# EAGLE design sailpi-hat (EAGLE 7.3.0)
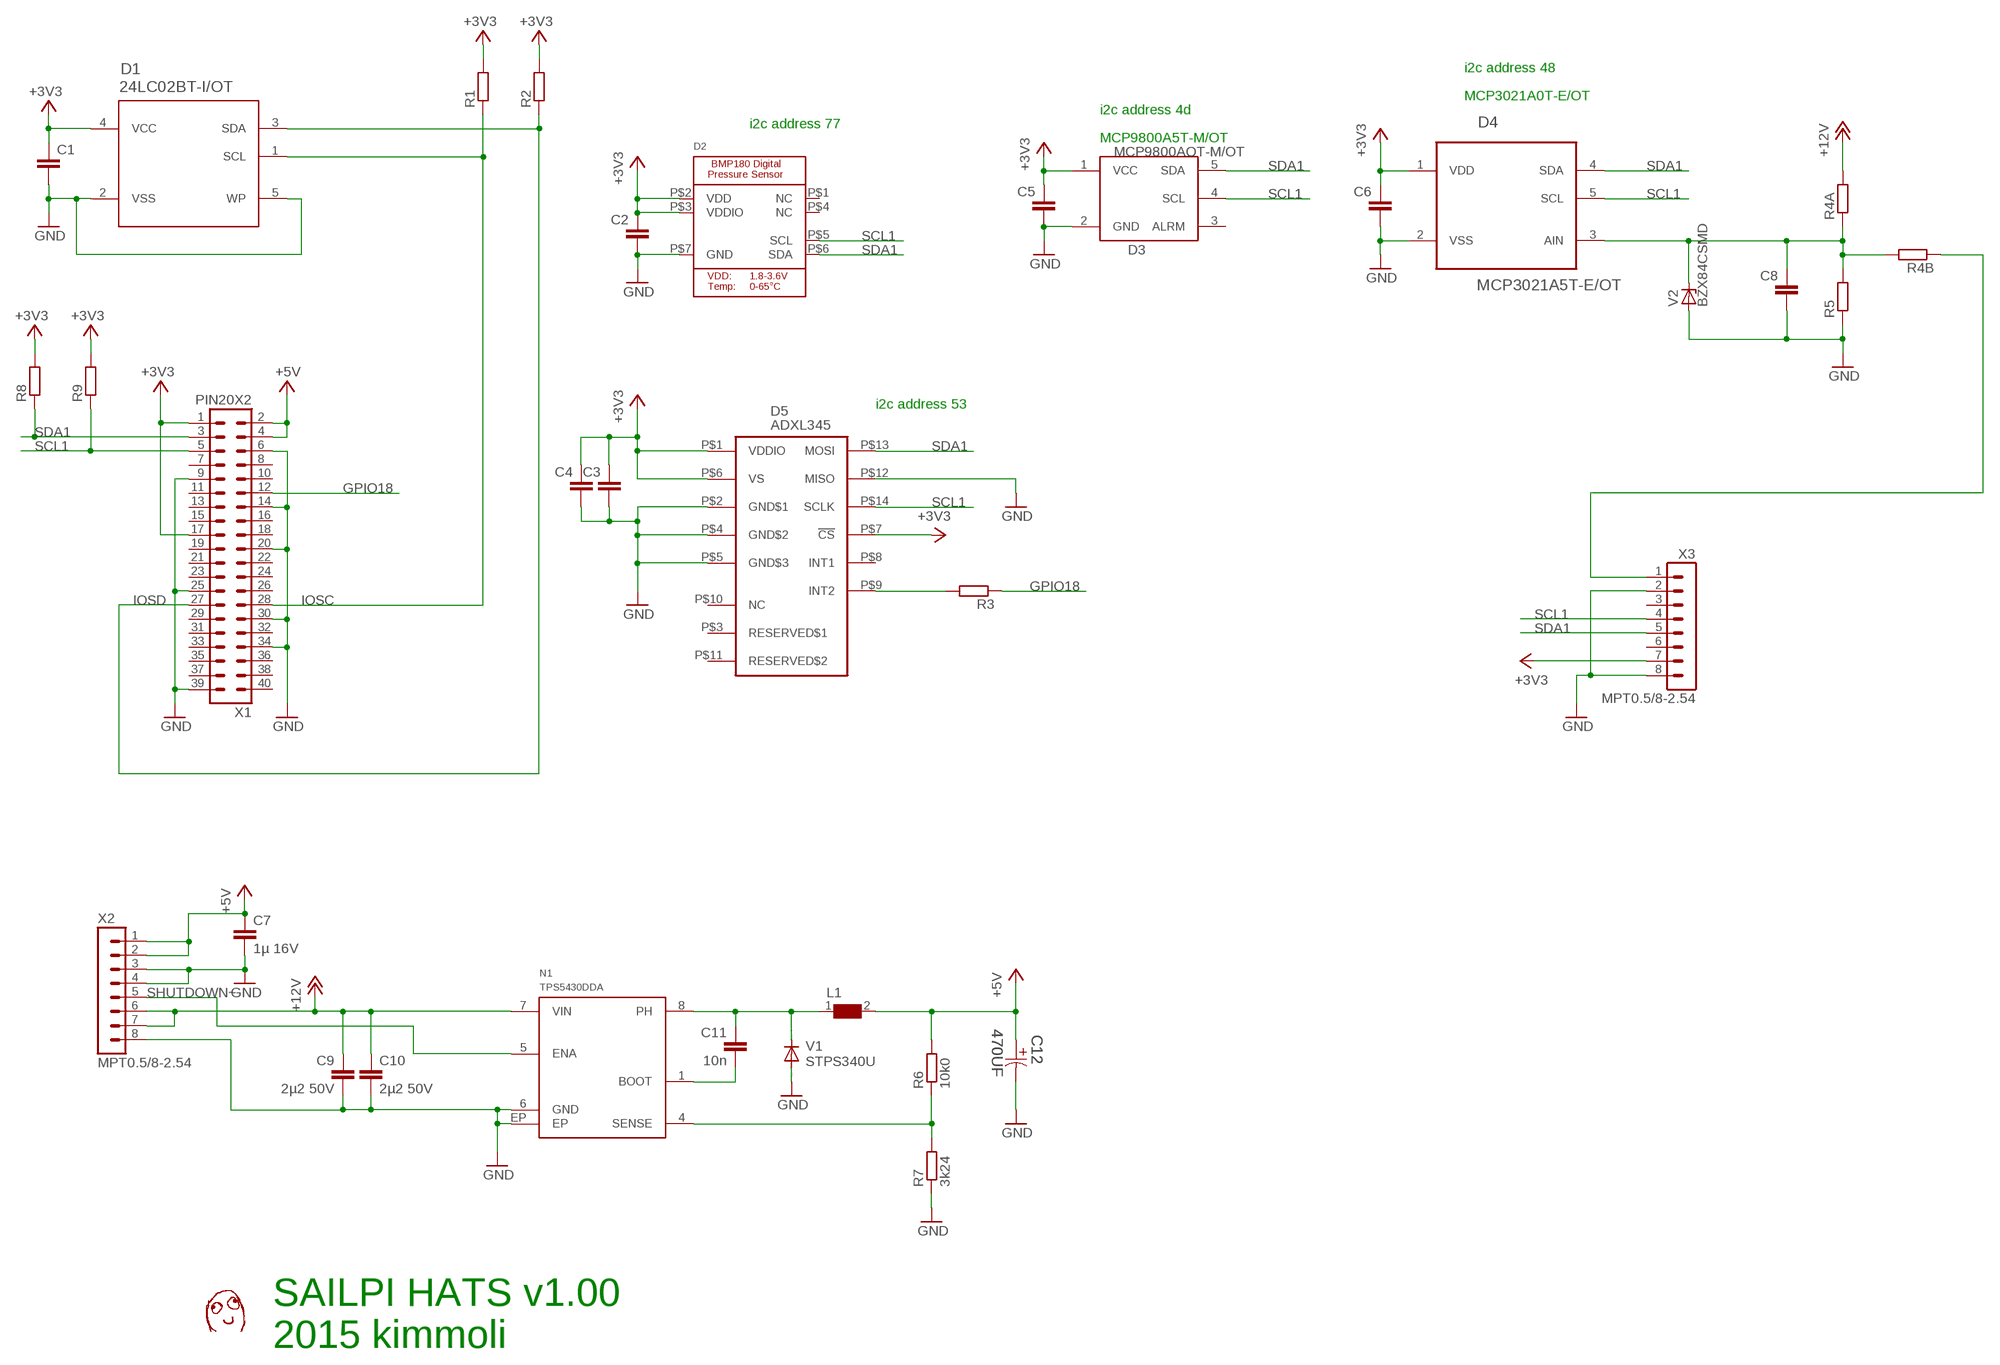
[diagram p0: schematic, sheet 1]

## Parts
C1  CAP0603  [C0603]
C2  CAP0603  [C0603]
C3  CAP0603  [C0603]
C4  CAP0603  [C0603]
C5  CAP0603  [C0603]
C6  CAP0603  [C0603]
C7  1µ 16V  CAP0805  [C0805]
C8  CAP0603  [C0603]
C9  2µ2 50V  CAP0805  [C0805]
C10  2µ2 50V  CAP0805  [C0805]
C11  10n  CAP0805  [C0805]
C12  470UF  EEV-FK1V471Q-CASE-H13  [CAPAE1350X1400N]
D1  24LC02BT-I/OT  [SOT95P280X145-5N]
D2  BMP180EXT  [BMP180_EXTENDED]
D3  MCP9800AOT-M/OT  [SOT23-5]
D4  MCP3021A5T-E/OT  [SOT95P270X145-5N]
D5  ADXL345  [LGA14]
L1  WE-PD-7447709220_1260/1245/1280/1210  [WE-PD_1260/1245/1280/1210]
N1  TPS5430DDA  [SOIC8-N-EP]
R1  RES0603  [R0603]
R2  RES0603  [R0603]
R3  RES0603  [R0603]
R4A  RES0603  [R0603]
R4B  RES0603  [R0603]
R5  RES0603  [R0603]
R6  10k0  RES0603  [R0603]
R7  3k24  RES0603  [R0603]
R8  RES0603  [R0603]
R9  RES0603  [R0603]
U$2  DAFUG  [DAFUG]
V1  STPS340U  DIODE-SMB  [SMB]
V2  BZX84CSMD  [TO236]
X1  PIN20X2  [PIN_20X2]
X2  MPT0.5/8-2.54  [MPT0.5/8-2.54]
X3  MPT0.5/8-2.54  [MPT0.5/8-2.54]

## Nets
+3V3: C1.1 C2.1 C3.1 C4.1 C5.1 C6.1 D1.4(VCC) D2.P$2(VDD) D2.P$3(VDDIO) D3.1(VCC) D4.1(VDD) D5.P$1(VDDIO) D5.P$6(VS) D5.P$7(!CS) R1.2 R2.2 R8.2 R9.2 X1.1 X1.17 X3.7
+5V: C7.1 C12.1 L1.2 R6.2 X1.2 X1.4 X2.1 X2.2
+12V: C9.1 C10.1 N1.7(VIN) R4A.2 X2.6 X2.7
GND: C1.2 C2.2 C3.2 C4.2 C5.2 C6.2 C7.2 C8.2 C9.2 C10.2 C12.2 D1.2(VSS) D1.5(WP) D2.P$7(GND) D3.2(GND) D4.2(VSS) D5.P$2(GND$1) D5.P$4(GND$2) D5.P$5(GND$3) D5.P$12(MISO) N1.6(GND) N1.EP R5.1 R7.1 V1.A V2.A X1.6 X1.9 X1.14 X1.20 X1.25 X1.30 X1.34 X1.39 X2.3 X2.4 X2.8 X3.2 X3.8
GPIO18: R3.1 X1.12
IOSC: D1.1(SCL) R1.1 X1.28
IOSD: D1.3(SDA) R2.1 X1.27
N$1: D5.P$9(INT2) R3.2
N$3: R4B.1 X3.1
N$4: C8.1 D4.3(AIN) R4A.1 R4B.2 R5.2 V2.C
N$43: C11.1 L1.1 N1.8(PH) V1.C
N$58: C11.2 N1.1(BOOT)
N$60: N1.4(SENSE) R6.1 R7.2
SCL1: D2.P$5(SCL) D3.4(SCL) D4.5(SCL) D5.P$14(SCLK) R9.1 X1.5 X3.4
SDA1: D2.P$6(SDA) D3.5(SDA) D4.4(SDA) D5.P$13(MOSI) R8.1 X1.3 X3.5
SHUTDOWN~: N1.5(ENA) X2.5
Unconnected: D2.P$1(NC) D2.P$4(NC) D3.3(ALRM) D5.P$3(RESERVED$1) D5.P$8(INT1) D5.P$10(NC) D5.P$11(RESERVED$2) X1.7 X1.8 X1.10 X1.11 X1.13 X1.15 X1.16 X1.18 X1.19 X1.21 X1.22 X1.23 X1.24 X1.26 X1.29 X1.31 X1.32 X1.33 X1.35 X1.36 X1.37 X1.38 X1.40 X3.3 X3.6

## Notes on the sheet
- i2c address 48
- MCP3021A0T-E/OT
- i2c address 4d
- i2c address 77
- MCP9800A5T-M/OT
- i2c address 53
- SAILPI HATS v1.00
- 2015 kimmoli

## Library data of the parts
C1-C6 C8 = omat_ic_2:CAP
C7 C9-C11 = OMAT_IC:CAP
C12 = EKE:EEV-: Aluminum Electrolytic Capacitors,Surface Mount Type; MPN: EEVFK1V471Q; OC_FARNELL: 2282105; OC_NEWARK: 53W3911; SUPPLIER: PANASONIC; TOLERANCE: ±20 %; VOLTAGERATING: 35V
D1 = omat_ic_2:24LC02BT-I/OT: Serial EEPROM; MPN: 24LC02BT-I/OT; OC_FARNELL: 9757910; OC_NEWARK: 89C9800; PACKAGE: SOT23-5; SUPPLIER: MICROCHIP
D2 = omat_ic_2:BMP180: BMP180 Digital Pressure Sensor 1.8-3.6V Supply, I2C Interface
D3 = EKE:MCP9800AOT-M/OT
D4 = omat_ic_2:MCP3021A5T-E/OT: A/D Converter; MPN: MCP3021A5T-E/OT; OC_FARNELL: 1332097; OC_NEWARK: 34M7445; PACKAGE: SOT-5; SUPPLIER: Microchip
D5 = omat_ic_2:ADXL345: 3-Axis, ±2 g/±4 g/±8 g/±16 g Digital Accelerometer
L1 = WE-PD:WE-PD: SMD-Shielded Power Inductors WE-PD - Magnetically shielded version which results in a low leakage field - High storage capacity - Low self-losses - Highest possible current loading for SMD-Inducors -- Switching regulators with low operating voltages (computer, laptop, mobile phones, pagers) -- Integrated DC/DC-converter -- Is recommended for the application with switching regulators from National Semiconductor, Linear Technology, Texas Instruments and Fairchild Semiconductor, ect. -- Graphic cards -- Plastic base: Because of the one piece construction these are more suitable for high vibration or shock applications; MPN: 7447709220; OC_FARNELL: 1635945; OC_NEWARK: 08P2775; PACKAGE: 1210; SUPPLIER: Wuerth Elektronik
N1 = OMAT_IC:TPS5430
R1-R3 R4A R4B R5 R8 R9 = omat_ic_2:RES
R6 R7 = OMAT_IC:RES
U$2 = dafug:DAFUG
V1 = diode:DIODE-: DIODE
V2 = EKE:BZX84CSMD: Z DIODE
X1 = FLYFISH:PIN20X2
X2 X3 = omat_ic_2:MPT0.5/8-2.54

## Board
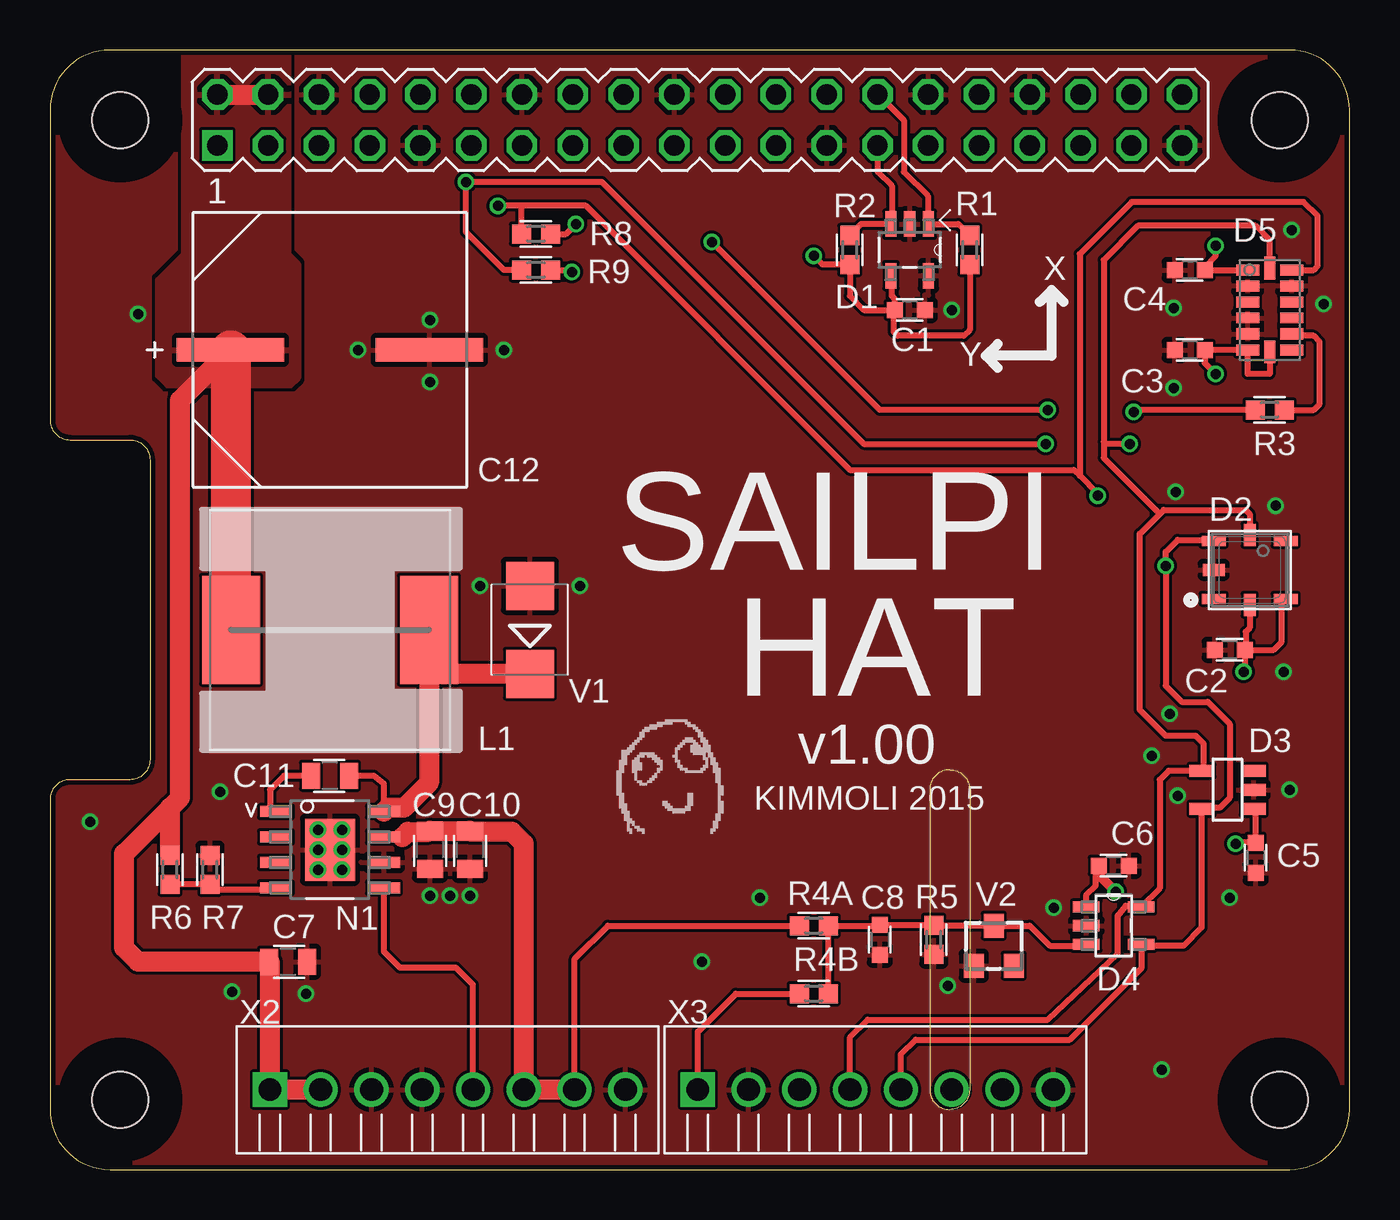
[diagram p1: board, top side]
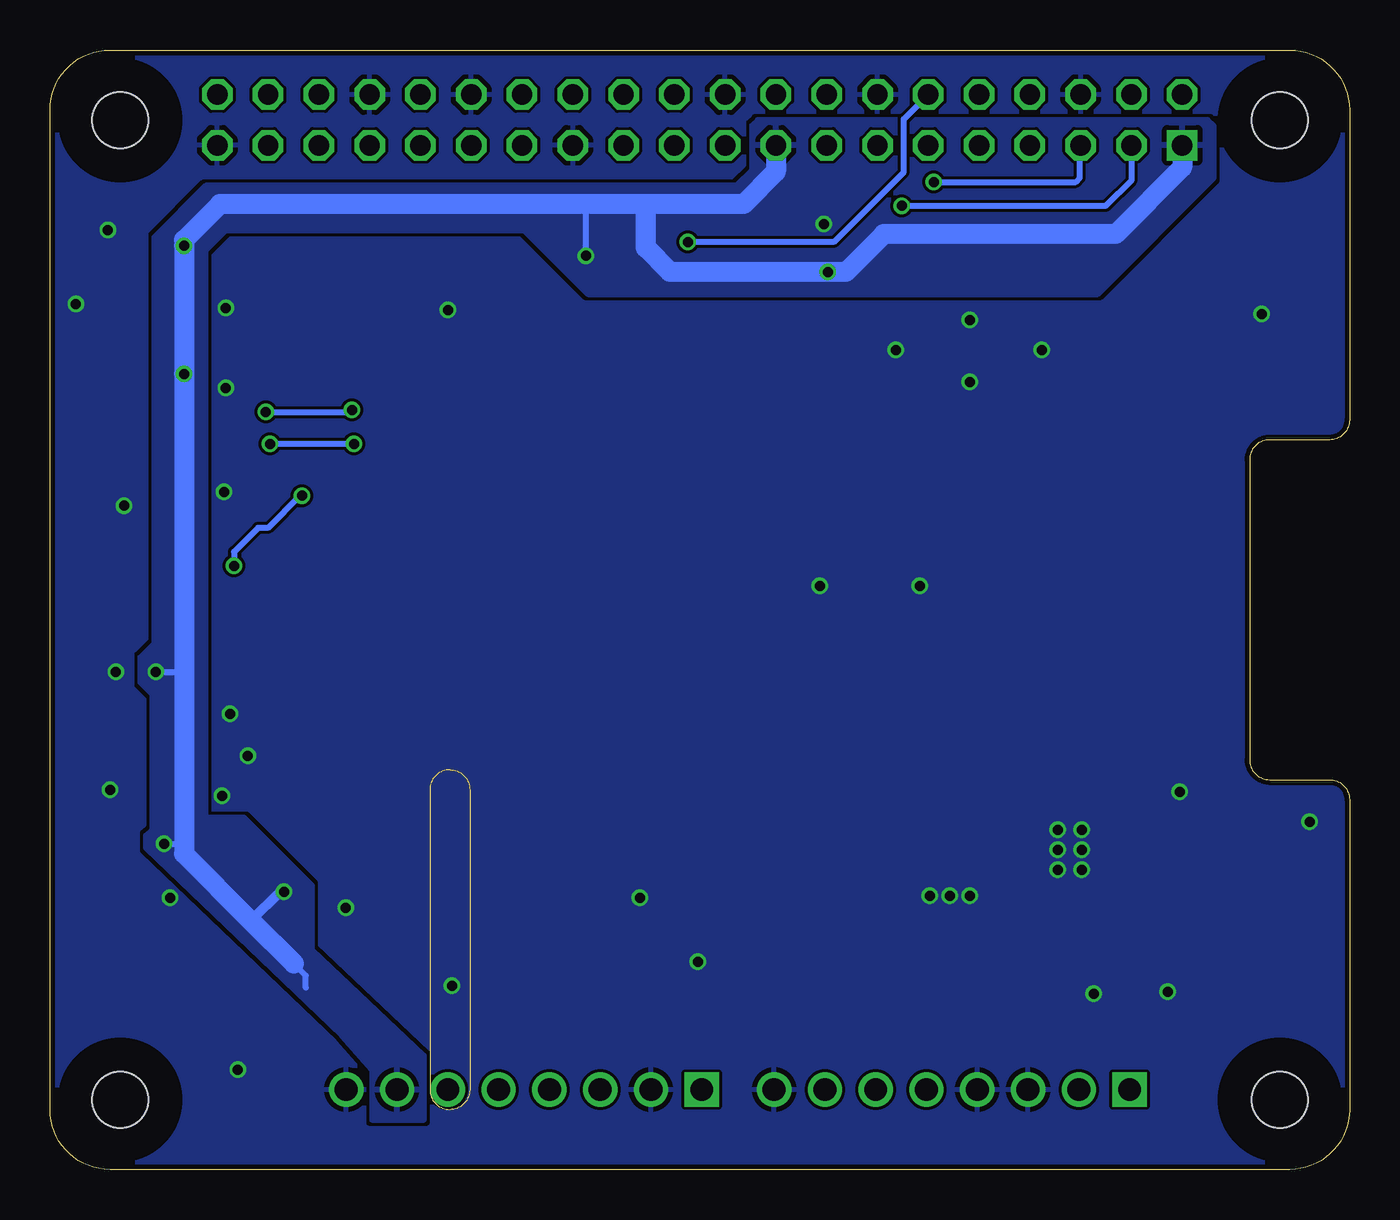
[diagram p2: board, bottom side, seen from below]

Size 65 x 56 mm. Coordinates in mm from the lower left corner, seen from the top.
Outline: 0,3 arc90 3,0 62,0 arc90 65,3 65,53 arc90 62,56 3,56 arc90 0,53 0,37.5 arc90 1,36.5 4,36.5 arc-90 5,35.5 5,20.5 arc-90 4,19.5 1,19.5 arc90 0,18.5 0,3
Copper layers (1*16): Top 0.035mm / dielectric 1.5mm / Bottom 0.035mm
Design rules "ITEADstudio_DRC": minimum track width 6mil, minimum drill 12mil, track to track 6mil, track to pad 6mil, pad to pad 6mil, via to via 6mil, smd to smd 0mil, copper to edge 10mil, drill to drill 10mil, minimum pad ring 10mil, minimum via ring 6mil, stop-mask expansion 2mil, vias tented up to drill 100mil, thermal gap 10mil
Holes 2.8 mm at 3.5,3.5 3.5,52.5 61.5,52.5 61.5,3.5
tRestrict: area 1.9,51 to 5,54; area 60,51 to 63,54; area 60,1.9 to 63,5; area 1.9,1.9 to 5,5
bRestrict: area 1.9,1.9 to 5,5; area 1.9,51 to 5,54; area 60,1.9 to 63,5; area 60,51 to 63,54
Milling: 6 lines

### Footprints (pad centres in the part's own frame; a part is rotated, then mirrored left to right if it is on the bottom)
C0603 = smd 0.8 x 0.8: 1 -0.75,0; 2 0.75,0
C0805 = smd 0.9 x 1.3: 1 -0.95,0; 2 0.95,0
CAPAE1350X1400N = smd 5.359 x 1.194: 1 -4.978,0; 2 4.978,0
SOT95P280X145-5N = smd 1.27 x 0.559: 1 -1.295,0.94; 2 -1.295,0; 3 -1.295,-0.94; 4 1.295,-0.94; 5 1.295,0.94
BMP180_EXTENDED = smd 1.2 x 0.5: P$1 -1.8,-1.45; P$3 1.8,-1.45; P$4 1.8,1.45; P$6 -1.8,1.45 | smd 0.6 x 1.1: P$2 0,-1.75; P$5 0,1.75 | smd 1.1 x 0.6: P$7 -1.8,0
SOT23-5 = smd 0.6 x 1.2: 1 -0.95,-1.306; 2 0,-1.306; 3 0.95,-1.306; 4 0.95,1.306; 5 -0.95,1.306
SOT95P270X145-5N = smd 1.321 x 0.559: 1 -1.372,0.94; 2 -1.372,0; 3 -1.372,-0.94; 4 1.372,-0.94; 5 1.372,0.94
LGA14 = smd 1.15 x 0.55: P$1 -1.1,2; P$2 -1.1,1.2; P$3 -1.1,0.4; P$4 -1.1,-0.4; P$5 -1.1,-1.2; P$6 -1.1,-2; P$8 1.1,-2; P$9 1.1,-1.2; P$10 1.1,-0.4; P$11 1.1,0.4; P$12 1.1,1.2; P$13 1.1,2 | smd 0.55 x 1.15: P$7 0,-2.1; P$14 0,2.1
WE-PD_1260/1245/1280/1210 = smd 2.9 x 5.4: 1 -4.95,0; 2 4.95,0
SOIC8-N-EP = smd 1.6 x 0.559: 1 -2.7,1.905; 2 -2.7,0.635; 3 -2.7,-0.635; 4 -2.7,-1.905; 5 2.7,-1.905; 6 2.7,-0.635; 7 2.7,0.635; 8 2.7,1.905 | smd 2.5 x 3.1: EP 0,0
R0603 = smd 0.95 x 0.95: 1 -0.725,0; 2 0.725,0
SMB = smd 2.4 x 2.4: A 2.2,0; C -2.2,0
TO236 = smd 1 x 1.2: A -1,-1; C 0,1; NC 1,-1
PIN_20X2 = drill 1.016 square: 1 -24.13,-1.27 | drill 1.016 octagon: 2 -24.13,1.27; 3 -21.59,-1.27; 4 -21.59,1.27; 5 -19.05,-1.27; 6 -19.05,1.27; 7 -16.51,-1.27; 8 -16.51,1.27; 9 -13.97,-1.27; 10 -13.97,1.27; 11 -11.43,-1.27; 12 -11.43,1.27; 13 -8.89,-1.27; 14 -8.89,1.27; 15 -6.35,-1.27; 16 -6.35,1.27; 17 -3.81,-1.27; 18 -3.81,1.27; 19 -1.27,-1.27; 20 -1.27,1.27; 21 1.27,-1.27; 22 1.27,1.27; 23 3.81,-1.27; 24 3.81,1.27; 25 6.35,-1.27; 26 6.35,1.27; 27 8.89,-1.27; 28 8.89,1.27; 29 11.43,-1.27; 30 11.43,1.27; 31 13.97,-1.27; 32 13.97,1.27; 33 16.51,-1.27; 34 16.51,1.27; 35 19.05,-1.27; 36 19.05,1.27; 37 21.59,-1.27; 38 21.59,1.27; 39 24.13,-1.27; 40 24.13,1.27
MPT0.5/8-2.54 = drill 1.143 square: 1 0,0 | drill 1.143: 2 2.54,0; 3 5.08,0; 4 7.62,0; 5 10.16,0; 6 12.7,0; 7 15.24,0; 8 17.78,0

### Placement (x,y rotation side)
C1  43,43 0 top
C2  59,26 180 top
C3  57,41 180 top
C4  57,45 180 top
C5  60.3,15.6 270 top
C6  53.2,15.2 0 top
C7  11.9,10.4 0 top
C8  41.5,11.5 270 top
C9  19,16 270 top
C10  21,16 270 top
C11  14,19.7 180 top
C12  14,41 0 top
D1  43,46 270 top
D2  60,30 0 top
D3  58.9,19 90 top
D4  53.2,12.2 0 top
D5  61,43 0 top
L1  14,27 180 top
N1  14,16 0 top
R1  46,46 270 top
R2  40,46 270 top
R3  61,38 0 top
R4A  38.2,12.2 180 top
R4B  38.2,8.8 0 top
R5  44.2,11.5 90 top
R6  6,15 90 top
R7  8,15 270 top
R8  24.3,46.8 0 top
R9  24.3,45 0 top
U$2  31.2,19.4 0 top
V1  24,27 90 top
V2  47.2,11.2 0 top
X1  32.5,52.5 0 top
X2  11,4 0 top
X3  32.4,4 0 top

### Tracks (layer width: path | path; a pad name or v marks a point on that pad's centre or on a via)
+3V3  (via drill 0.5)
  Top 0.3: D2.P$2 60,27.1 59.8,26.9 59.8,26.05 C2.1 | C2.1 61.2,26 61.6,26.4 61.6,28.35 D2.P$3 | C1.1 40.7,43 40,43.7 R2.2 38.62,45.27 v38.2,45.7 | C1.1 42.25,43.55 42.1,43.7 42.1,44.66 D1.4 | R1.2 46,42 45.7,41.7 42.4,41.7 42.2,41.9 42.2,42.95 C1.1 | D5.P$1 C4.1 57.75,45.15 58.3,45.7 v58.3,46.2 | D5.P$7 61,39.8 59.9,39.8 D5.P$6 C3.1 57.75,40.35 v58.3,39.8 | D4.1 51.83,13.73 52.3,14.2 52.3,15.05 C6.1 | v59.3,16.3 59.36,16.36 C5.1 60.3,17.96 D3.1 | C2.1 59.75,24.95 v59.7,24.9 | R8.2 25.8,46.8 v26.3,47.3 | R9.2 26,45 v26.1,44.9
  Top 0.5: v53.3,13.9 52.45,14.75 C6.1
  Bottom 0.3: 52.2,9.1 52.2,9.7 52.8,10.3 | v59.3,16.3 58.3,16.3 | v59.7,24.9 58.3,24.9 | v38.2,45.7 38.2,48.1 38,48.3
  Bottom 0.5: v53.3,13.9 53.5,13.9 54.95,12.45
  Bottom 1: X1.17 28.69,49.91 30.3,48.3 35.3,48.3 | 35.3,48.3 38,48.3 56.5,48.3 58.3,46.5 v58.3,46.2 v58.3,39.8 58.3,24.9 58.3,16.3 58.3,15.8 54.95,12.45 52.8,10.3 | X1.1 8.37,50.13 11.7,46.8 23.3,46.8 25.2,44.9 v26.1,44.9 34,44.9 35.2,46.1 35.2,48.2 35.3,48.3
  pour Bottom: 7.1,52.5 29.6,52.5 29.9,52.2 29.9,50 30.7,49.2 57.2,49.2 59.8,46.6 59.8,26.3 60.5,25.6 60.5,24.4 59.9,23.8 59.9,17 60.2,16.7 60.2,16.1 50.4,6.7 48.9,5 48.9,2.5 46.3,2.5 46.3,5.7 51.9,11 51.9,14.2 55.3,17.6 57.2,17.6 57.2,46 56.2,47 41.3,47 38.1,43.8 12.6,43.8 6.8,49.6 6.8,52.2
+5V
  Top 1: 9.05,40.97 C12.1 6.5,38.48 6.5,18.6 6,18.1 | R6.2 6,18.1 | X2.2 X2.1 11,10.35 C7.1 4.4,10.4 3.7,11.1 3.7,15.8 6,18.1 | X1.2 X1.4
  Top 2: L1.2 9.05,40.97
  pour Top: 6.7,55.8 11.9,55.8 11.9,45.8 12.4,45.3 12.4,39.6 12,39.2 5.9,39.2 5.4,39.7 5.4,44.5 6.7,45.8
+12V
  Top 0.3: 18.95,16.9 C9.1 | X2.7 26.24,10.54 27.9,12.2 R4A.2
  Top 0.5: N1.7 17.64,16.64
  Top 1: 17.64,16.64 17.9,16.9 18.95,16.9 | C9.1 C10.1 21.05,16.9 23.1,16.9 23.7,16.3 X2.6 X2.7
GND  (via drill 0.5)
  other vias: 45.1,43 56.2,39.1 56.2,43.1 63.7,43.3 62.1,47 56.3,33.9 61.3,33.2 61.7,24.9 59,13.6 62,19 55.1,20.7 56,22.8 56.4,18.7 55.6,5 50.2,13.1 44.9,9.2 13.4,17 14.6,17 14.6,15 13.4,15 13.4,16 14.6,16 21.5,29.2 26.5,29.2 19,42.5 19,39.4 22.7,41 15.4,41 4.4,42.8 2,17.4 8.5,18.9 12.8,8.8 19,13.7 20,13.7 21,13.7 9.1,8.9 35.5,13.6 32.6,10.4
  pour Bottom (rank 2): 0,3 arc90 3,0 62,0 arc90 65,3 65,53 arc90 62,56 3,56 arc90 0,53 0,37.5 arc90 1,36.5 4,36.5 arc-90 5,35.5 5,20.5 arc-90 4,19.5 1,19.5 arc90 0,18.5
  pour Top (rank 2): 0,3 arc90 3,0 62,0 arc90 65,3 65,53 arc90 62,56 3,56 arc90 0,53 0,37.5 arc90 1,36.5 4,36.5 arc-90 5,35.5 5,20.5 arc-90 4,19.5 1,19.5 arc90 0,18.5
GPIO18  (via drill 0.5)
  Top 0.3: R3.1 54.3,38 v54.2,37.9 | v49.9,38 41.5,38 v33.1,46.4
  Bottom 0.3: v54.2,37.9 50,37.9 v49.9,38 | X1.12 22.3,52.54 22.3,49.9 25.8,46.4 v33.1,46.4
IOSC
  Top 0.3: X1.28 41.43,53.77 42.7,52.5 42.7,49.9 43.9,48.7 43.9,47.34 D1.1 45.43,47.3 R1.1
IOSD
  Top 0.3: X1.27 41.39,49.91 42.1,49.2 42.1,47.34 D1.3 40.57,47.3 R2.1
N$1
  Top 0.3: R3.2 63.2,38 63.5,38.3 63.5,41.4 63.2,41.7 62.2,41.7 D5.P$9
N$3
  Top 0.3: X3.1 32.4,6.9 34.3,8.8 R4B.1
N$4
  Top 0.3: R4B.2 R4A.1 41.45,12.2 C8.1 44.17,12.25 R5.2 47.17,12.22 V2.C 49,12.2 50,11.2 51.77,11.2 D4.3
N$43
  Top 0.3: N1.8 16.7,19.3 16.2,19.7 C11.1
  Top 1: L1.1 18.95,25.3 | 18.95,25.3 18.95,19.35 17.7,18.1 16.89,18.1 N1.8 | V1.C 19.45,24.8 18.95,25.3
N$58
  Top 0.3: C11.2 11.7,19.7 11,19 11,18.2 N1.1
N$60
  Top 0.3: N1.4 11,14.1 11,14 8,14 R7.2 R6.1
SCL1  (via drill 0.5)
  Top 0.3: 55.5,32.8 54.5,31.8 54.5,23 55.8,21.7 57.3,21.7 57.69,21.31 57.69,20.05 D3.4 55.95,19.95 55.5,19.5 55.5,14.07 D4.5 54.51,13.2 53.8,13.2 53.4,12.7 53.4,10.8 49.9,7.5 40.9,7.5 40.02,6.62 X3.4 | 55.5,32.8 55.7,33 59.8,33 60,32.8 D2.P$5 | D5.P$14 61,46.5 60.3,47.2 54.4,47.2 52.7,45.5 52.7,36.4 | 52.7,36.4 52.7,35.6 55.5,32.8 | v49.8,36.3 40.7,36.3 27.6,49.4 v20.8,49.4 20.8,46.9 22.7,45 R9.1 | v54,36.3 52.8,36.3 52.7,36.4
  Bottom 0.3: v49.8,36.3 v54,36.3 | v20.8,49.4 13.7,49.4 13.5,49.6 13.5,51.18 X1.5
SDA1  (via drill 0.5)
  Top 0.3: D5.P$13 63.2,45 63.4,45.2 63.4,47.7 62.7,48.4 54.1,48.4 51.5,45.8 51.5,34.7 | 51.5,34.7 51.2,35 40,35 26.8,48.2 23.6,48.2 | v52.4,33.7 52.4,33.8 51.5,34.7 | D2.P$6 58.15,31.5 56.4,31.5 55.8,30.9 v55.8,30.2 55.8,24.2 56.6,23.4 57.9,23.4 59,22.3 59,18.6 58.5,18.1 57.74,18.1 57.69,18.05 D3.5 57.59,12.09 56.7,11.2 54.63,11.2 D4.4 54.6,11.23 54.6,10.1 51,6.5 43.3,6.5 42.56,5.76 X3.5 | 23.6,48.2 v22.4,48.2 | R8.1 23.57,48.17 23.6,48.2
  Bottom 0.3: v52.4,33.7 52.5,33.7 54.1,32.1 54.6,32.1 55.8,30.9 v55.8,30.2 | v22.4,48.2 12.2,48.2 10.9,49.5 X1.3
SHUTDOWN~
  Top 0.3: X2.5 21.16,9.24 20.3,10.1 17.5,10.1 16.7,10.9 N1.5

### Text on the board
tPlace: X | Y | SAILPI | HAT | v1.00 | KIMMOLI 2015